# EAGLE schematic M_CircuitSchematic (EAGLE 7.4.0)
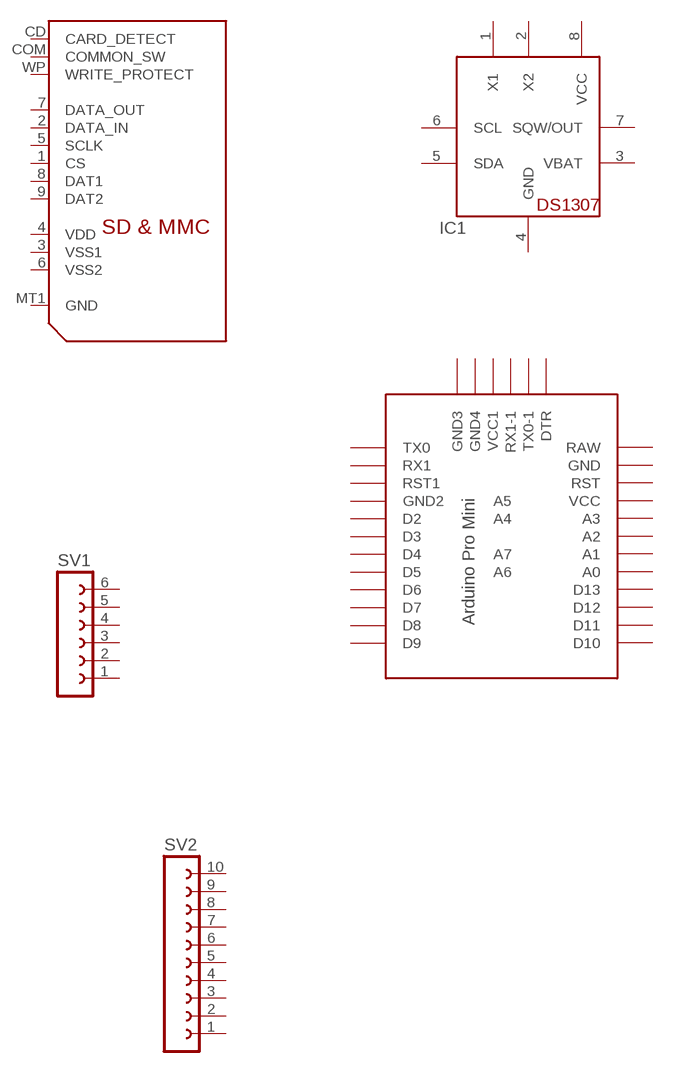
[diagram p0: schematic, sheet 1]

## Parts
IC1  DS1307  [DIL08]
SV1  FE06-1  [FE06]
SV2  FE10-1  [FE10]
U$1  PRO-MINI-2  [PRO-MINI-2]
U$2  SDMMC18650  [SDCARD]
Unconnected: IC1.1(X1) IC1.2(X2) IC1.5(SDA) IC1.6(SCL) IC1.7(SQW/OUT) SV1.1 SV1.2 SV1.3 SV1.4 SV1.5 SV1.6 SV2.1 SV2.2 SV2.3 SV2.4 SV2.5 SV2.6 SV2.7 SV2.8 SV2.9 SV2.10 U$1.A0 U$1.A1 U$1.A2 U$1.A3 U$1.A4 U$1.A5 U$1.A6 U$1.A7 U$1.D2 U$1.D3 U$1.D4 U$1.D5 U$1.D6 U$1.D7 U$1.D8 U$1.D9 U$1.D10 U$1.D11 U$1.D12 U$1.D13 U$1.DTR U$1.GND U$1.GND1(GND2) U$1.GND2(GND3) U$1.GND3(GND4) U$1.RAW U$1.RST U$1.RST1 U$1.RX1 U$1.RX1-1 U$1.TX0 U$1.TX0-1 U$1.VCC U$1.VCC1 U$2.1(CS) U$2.2(DATA_IN) U$2.3(VSS1) U$2.4(VDD) U$2.5(SCLK) U$2.6(VSS2) U$2.7(DATA_OUT) U$2.8(DAT1) U$2.9(DAT2) U$2.CD(CARD_DETECT) U$2.COM(COMMON_SW) U$2.MT1(GND) U$2.WP(WRITE_PROTECT)

## Power pins joined to a net without a drawn wire
GND: IC1.4(GND)
VBAT: IC1.3(VBAT)
VCC: IC1.8(VCC)

## Library data of the parts
IC1 = adafruit:DS1307: DS1307 Real time clock (RTC) with battery backup ability. Talk to it via i2c
SV1 = con-lsta:FE06-1: FEMALE HEADER; OC_FARNELL: unknown; OC_NEWARK: unknown
SV2 = con-lsta:FE10-1: FEMALE HEADER; OC_FARNELL: unknown; OC_NEWARK: unknown
U$1 = Arduino-clone:PRO-MINI-2: Arduino Pro Mini Layout 2 Sparkfun.com
U$2 = adafruit:SDMMC: SD MMC Card holder 4UCON part #06132 - easy to solder